# EAGLE design untitled (EAGLE 9.6.2)
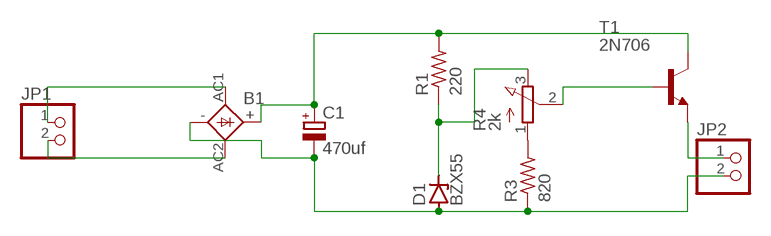
[diagram p0: schematic, sheet 1]

## Parts
B1  1KAB  [1KAB]
C1  470uf  CPOL-EUE3.5-10  [E3,5-10]
D1  BZX55  [DO35Z10]
JP1  PINHD-1X2  [1X02]
JP2  PINHD-1X2  [1X02]
R1  220  R-US_0309/12  [0309/12]
R3  820  R-US_0309/12  [0309/12]
R4  2k  3RP/1610N  [3RP/1610N]
T1  2N706  [TO18]

## Nets
N$2: R3.2 R4.1(A)
N$3: D1.C R1.1 R4.3(E)
N$5: JP2.1 T1.1(E)
N$6: B1.AC1 JP1.1
N$7: B1.AC2 JP1.2
N$8: B1.+ C1.+ R1.2 T1.3(C)
N$9: B1.- C1.- D1.A JP2.2 R3.1
N$10: R4.2(S) T1.2(B)

## Library data of the parts
B1 = rectifier:1KAB: RECTIFIER grid 5,08 x 5,08 mm
C1 = rcl:CPOL-EU: POLARIZED CAPACITOR, European symbol; SPICEPREFIX: C
D1 = diode:BZX55: Z DIODE
JP1 JP2 = pinhead:PINHD-1X2: PIN HEADER
R1 R3 = rcl:R-US_: RESISTOR, American symbol; SPICEPREFIX: R
R4 = pot:3RP/1610N: 16mm Potentiometer one level Source: http://www.alphapotentiometers.net/html/16mm_pot_2.html
T1 = transistor:2N706: NPN TRANSISTOR

## Board
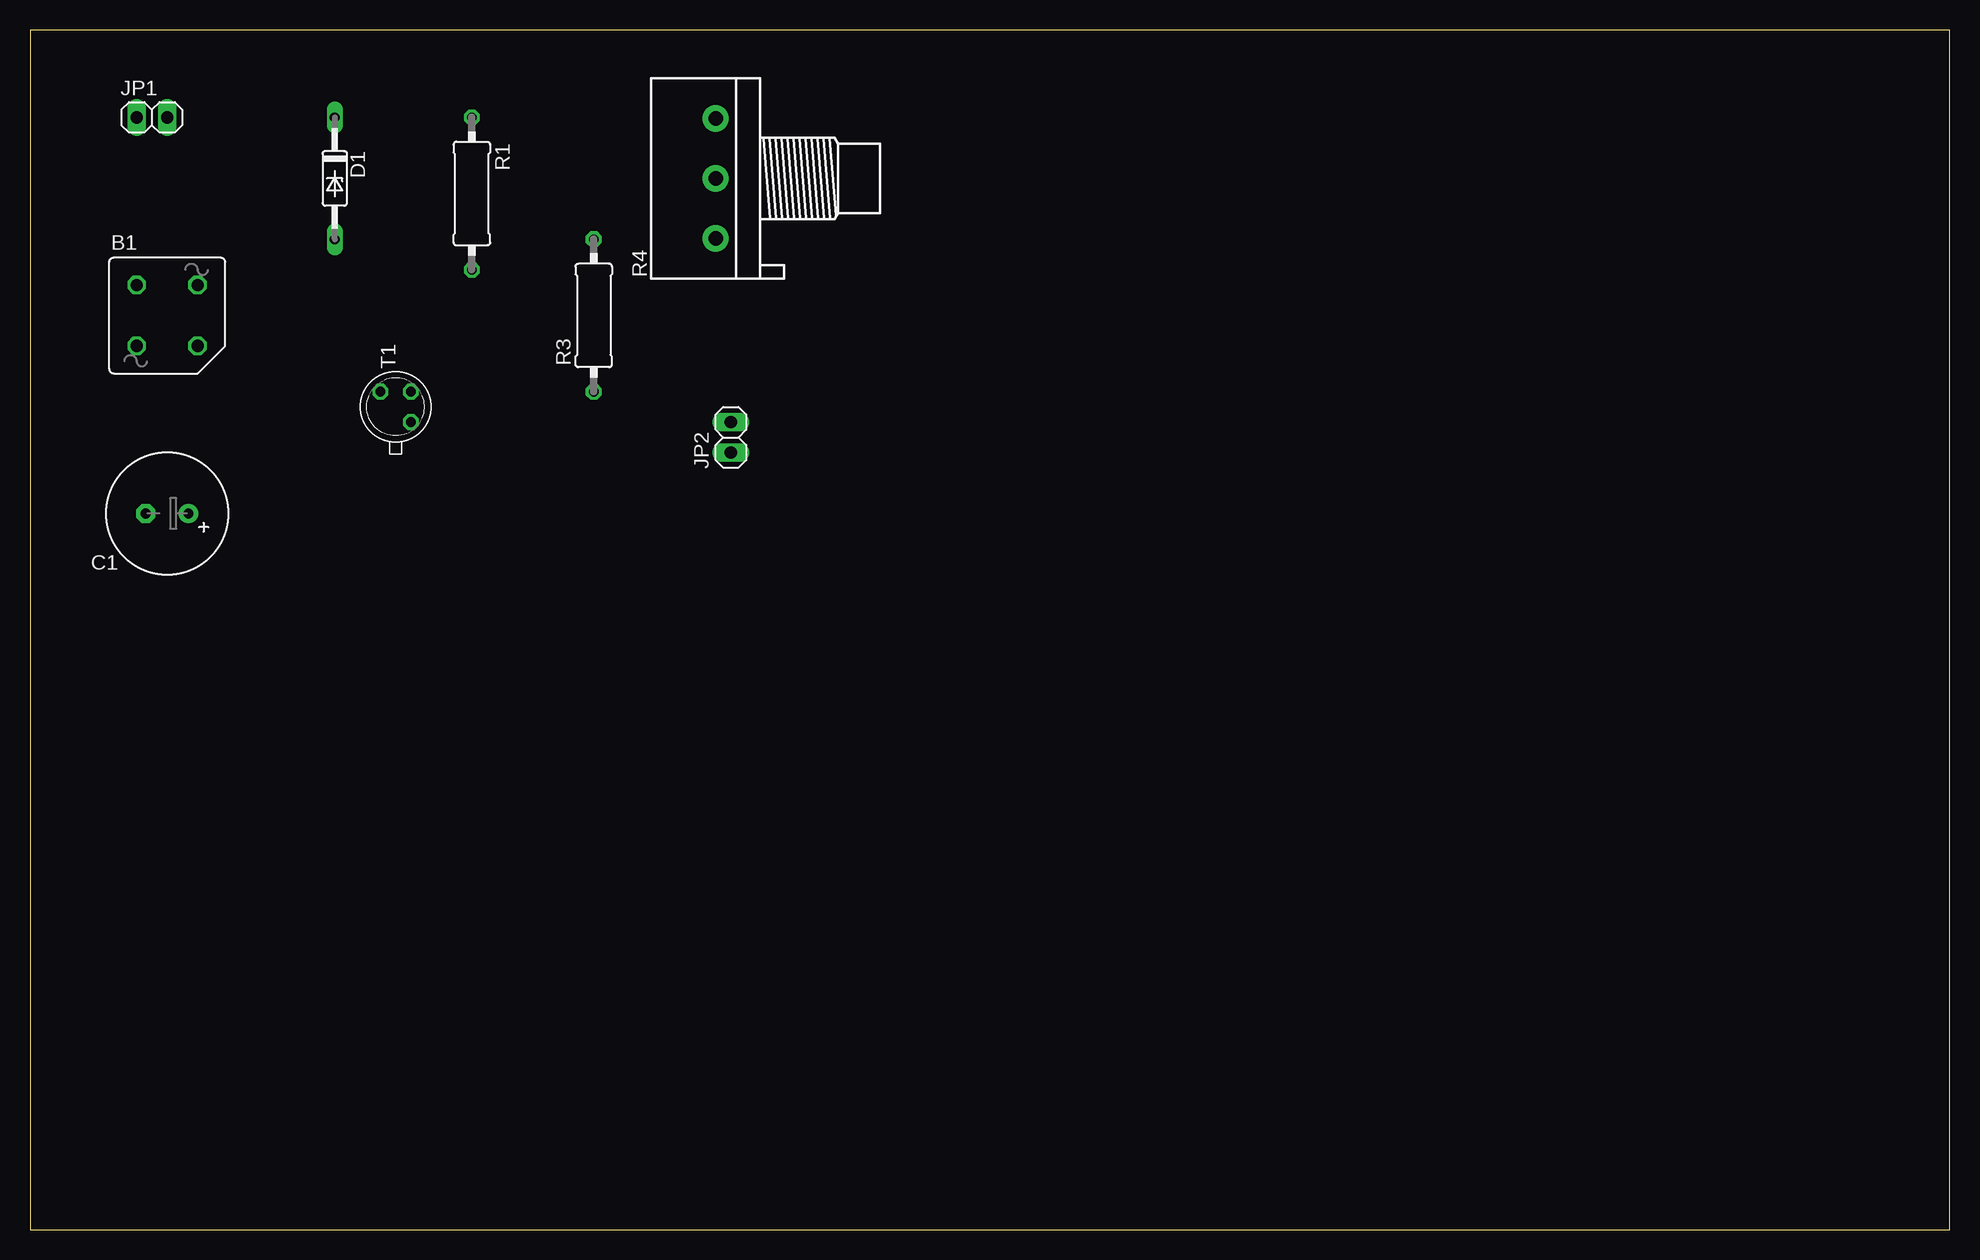
[diagram p1: board, top side]
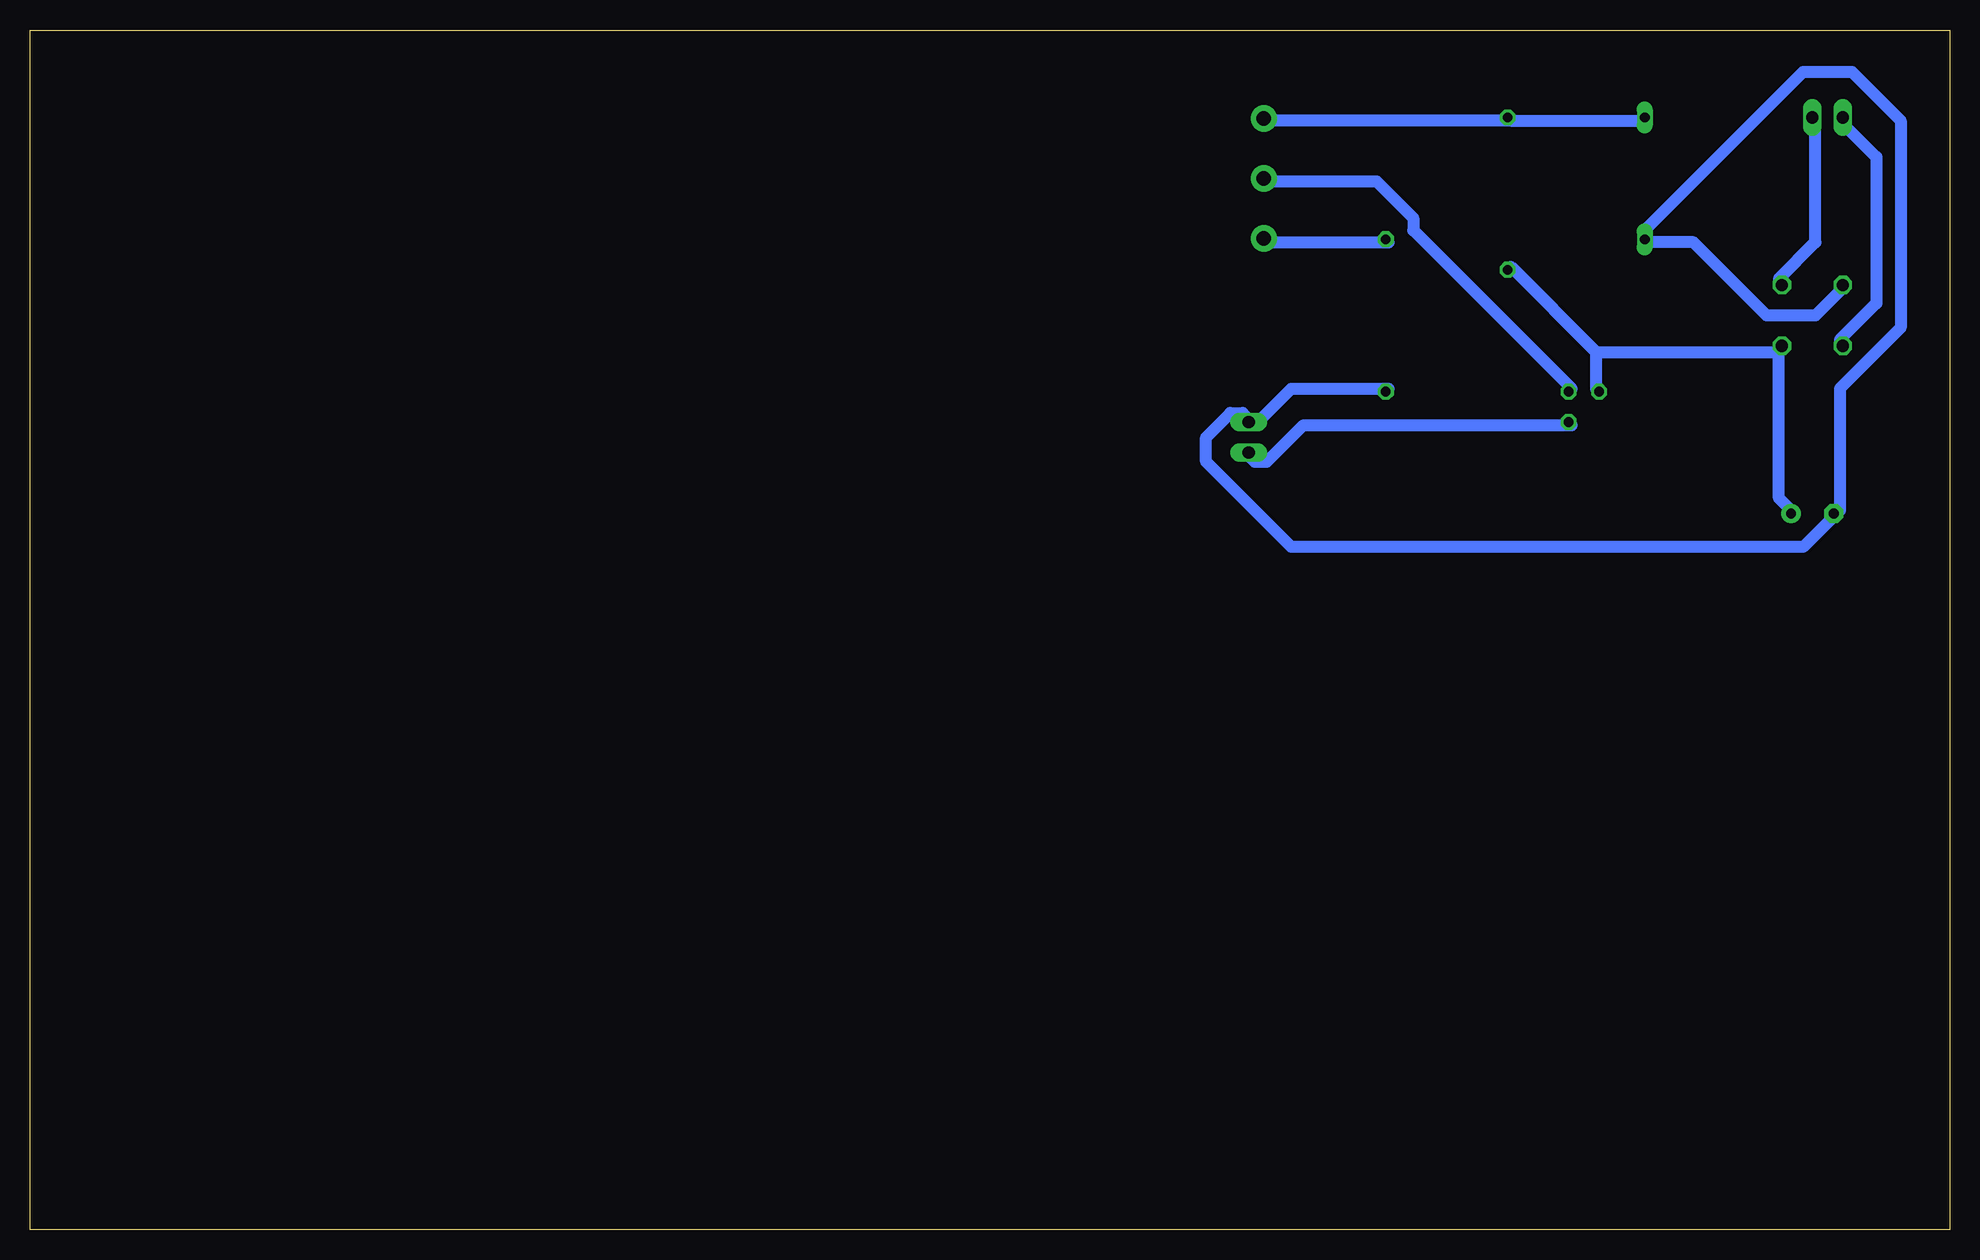
[diagram p2: board, bottom side, seen from below]

Size 160 x 100 mm. Coordinates in mm from the lower left corner, seen from the top.
Outline: 0,0 160,0 160,100 0,100 0,0
Copper layers (1*16): Top 0.035mm / dielectric 1.5mm / Bottom 0.035mm
Design rules "default *": minimum track width 40mil, minimum drill 0.35mm, track to track 40mil, track to pad 40mil, pad to pad 40mil, via to via 40mil, smd to smd 6mil, copper to edge 40mil, drill to drill 6mil, minimum pad ring 10mil, minimum via ring 8mil, stop-mask expansion 4mil, vias tented up to drill 0mil, thermal gap 10mil

### Footprints (pad centres in the part's own frame; a part is rotated, then mirrored left to right if it is on the bottom)
1KAB = drill 1.016 octagon: + 2.54,-2.54; - -2.54,2.54; AC1 -2.54,-2.54; AC2 2.54,2.54
E3,5-10 = drill 0.813 pad 1.6: + -1.778,0 | drill 0.813 pad 1.6 octagon: - 1.778,0
DO35Z10 = drill 0.813 long: A 5.08,0; C -5.08,0
1X02 = drill 1.016 long: 1 -1.27,0; 2 1.27,0
0309/12 = drill 0.813 octagon: 1 -6.35,0; 2 6.35,0
3RP/1610N = drill 1.2 pad 2.184: 1 -5,0; 2 0,0; 3 5,0
TO18 = drill 0.813 octagon: 1 -1.27,-1.27; 2 1.27,-1.27; 3 1.27,1.27

### Placement (x,y rotation side)
B1  11.43,76.2 0 top
C1  11.43,59.69 180 top
D1  25.4,87.63 270 top
JP1  10.16,92.71 0 top
JP2  58.42,66.04 90 top
R1  36.83,86.36 270 top
R3  46.99,76.2 90 top
R4  57.15,87.63 90 top
T1  30.48,68.58 90 top

### Tracks (layer width: path | path; a pad name or v marks a point on that pad's centre or on a via)
N$2
  Bottom 1.016: R3.2 46.74,82.3 56.9,82.3 R4.1
N$3
  Bottom 1.016: 36.58,92.46 25.4,92.46 D1.C | 36.58,92.46 56.9,92.46 R4.3 | 36.58,92.46 R1.1
N$5
  Bottom 1.016: T1.1 31.5,67.06 53.85,67.06 56.9,64.01 57.91,64.01 58.93,65.02 JP2.1
N$6
  Bottom 1.016: B1.AC1 9.14,74.17 6.1,77.22 6.1,89.41 9.14,92.46 JP1.1
N$7
  Bottom 1.016: JP1.2 11.18,92.46 11.18,82.3 14.22,79.25 B1.AC2
N$8
  Bottom 1.016: 14.22,73.15 14.22,60.96 13.21,59.94 C1.+ | 29.46,73.15 29.46,70.1 T1.3 | 29.46,73.15 36.58,80.26 R1.2 | 29.46,73.15 14.22,73.15 | 14.22,73.15 B1.+
N$9
  Bottom 1.016: 57.91,67.06 54.86,70.1 46.74,70.1 R3.1 | B1.- 9.14,78.23 11.18,76.2 15.24,76.2 21.34,82.3 25.4,82.3 D1.A 25.4,83.31 12.19,96.52 8.13,96.52 4.06,92.46 4.06,75.18 9.14,70.1 9.14,59.94 | 57.91,67.06 58.93,68.07 59.94,68.07 61.98,66.04 61.98,64.01 54.86,56.9 12.19,56.9 9.14,59.94 | 57.91,67.06 JP2.2 | 9.14,59.94 C1.-
N$10
  Bottom 1.016: T1.2 31.5,70.1 44.7,83.31 44.7,84.33 47.75,87.38 56.9,87.38 R4.2